# Altium schematic sheet Processor.SchDoc
size C
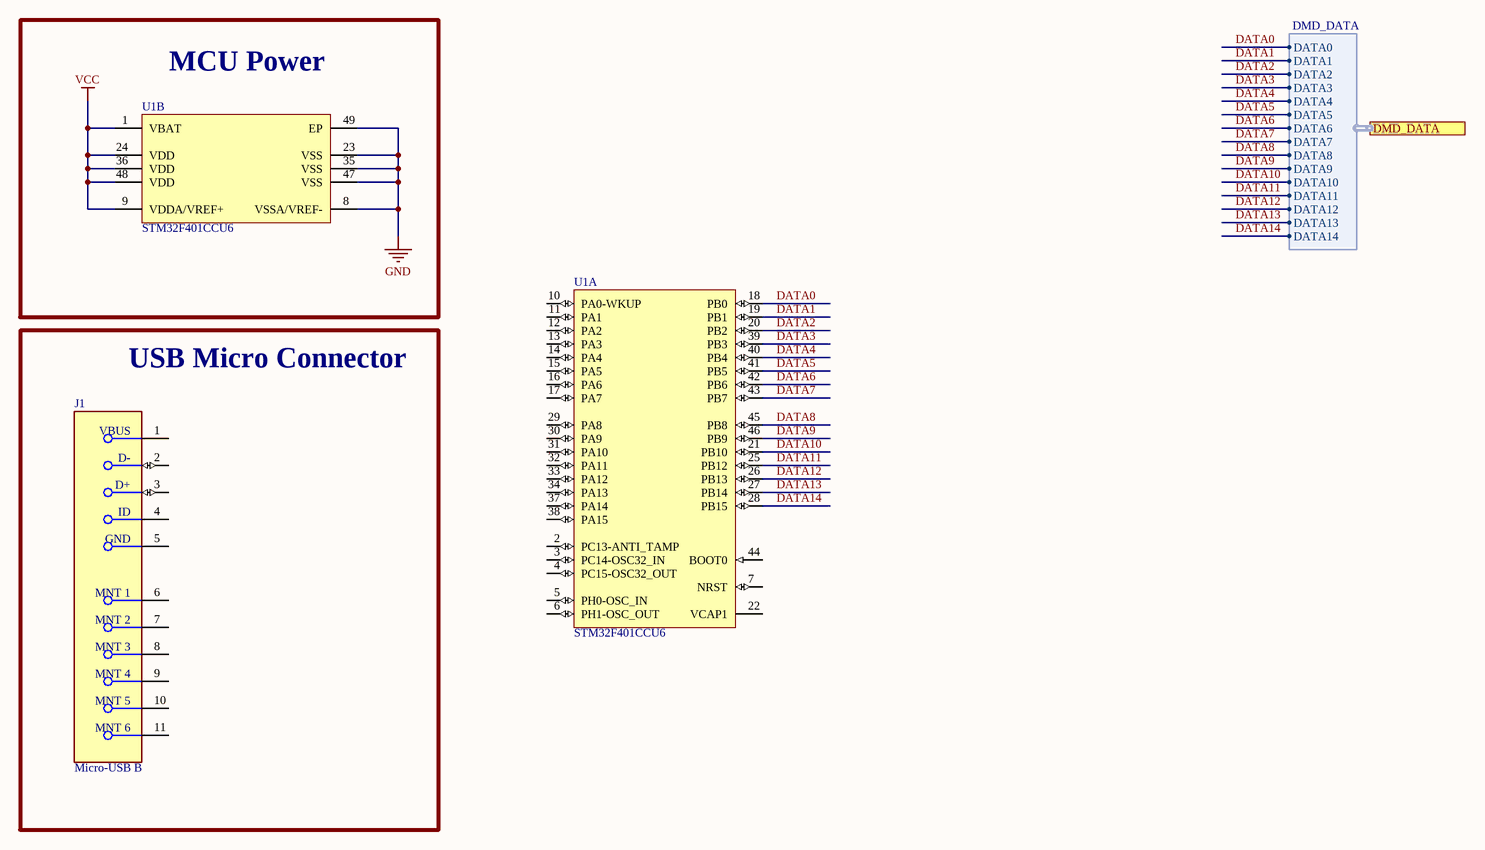
[diagram p0: Processor.SchDoc]

## Parts
J1  Micro-USB B
U1  STM32F401CCU6  [STM-UFQFPN48_N]  (parts A,B of 2)

## Blocks framed on the sheet
MCU Power: U1
USB Micro Connector: J1

## Ports
DMD_DATA (harness DMD_DATA)

## Harnesses
DMD_DATA: DATA0, DATA1, DATA2, DATA3, DATA4, DATA5, DATA6, DATA7, DATA8, DATA10, DATA11, DATA12, DATA13, DATA14, DATA9

## Nets
GND: U1.8(VSSA/VREF-) U1.23(VSS) U1.35(VSS) U1.47(VSS) U1.49(EP)
VCC: U1.1(VBAT) U1.9(VDDA/VREF+) U1.24(VDD) U1.36(VDD) U1.48(VDD)
DATA0: U1.18(PB0) ; port DMD_DATA.DATA0
DATA1: U1.19(PB1) ; port DMD_DATA.DATA1
DATA2: U1.20(PB2) ; port DMD_DATA.DATA2
DATA3: U1.39(PB3) ; port DMD_DATA.DATA3
DATA4: U1.40(PB4) ; port DMD_DATA.DATA4
DATA5: U1.41(PB5) ; port DMD_DATA.DATA5
DATA6: U1.42(PB6) ; port DMD_DATA.DATA6
DATA7: U1.43(PB7) ; port DMD_DATA.DATA7
DATA8: U1.45(PB8) ; port DMD_DATA.DATA8
DATA9: U1.46(PB9) ; port DMD_DATA.DATA9
DATA10: U1.21(PB10) ; port DMD_DATA.DATA10
DATA11: U1.25(PB12) ; port DMD_DATA.DATA11
DATA12: U1.26(PB13) ; port DMD_DATA.DATA12
DATA13: U1.27(PB14) ; port DMD_DATA.DATA13
DATA14: U1.28(PB15) ; port DMD_DATA.DATA14

Not connected (* = marked no-connect by the designer): J1 1(VBUS) 2(D-) 3(D+) 4(ID) 5(GND) 6(MNT_1) 7(MNT_2) 8(MNT_3) 9(MNT_4) 10(MNT_5) 11(MNT_6); U1 2(PC13-ANTI_TAMP) 3(PC14-OSC32_IN) 4(PC15-OSC32_OUT) 5(PH0-OSC_IN) 6(PH1-OSC_OUT) 7(NRST) 10(PA0-WKUP) 11(PA1) 12(PA2) 13(PA3) 14(PA4) 15(PA5) 16(PA6) 17(PA7) 22(VCAP1) 29(PA8) 30(PA9) 31(PA10) 32(PA11) 33(PA12) 34(PA13) 37(PA14) 38(PA15) 44(BOOT0)

## Notes on the sheet
- CONFIDENTAL. Do not distribute.
- Page Contents:
- Title:
- Company
- Logo
- Date:
- SIZE:
- C
- DWG Num:
- Time:
- Variant:
- Sheet
- Revision:
- of
- Drawn by:
- Checked by:

## Library data of the parts
J1 = 47346-0001: Micro-USB B Receptacle with Flange, Bottom Mount, Surface Mount, Lead-Free; Manufacturer: Molex; Supplier 1: Arrow Electronics; Manufacturer Part Number: 47346-0001; RoHS: Yes; Category: Headers and Wire Housings; Stock 1: 5771; Pricing 1: 1=1.09160, 10=0.90940, 25=0.90030, 100=0.76040, 250=0.75290, 500=0.74530, 1000=0.57460, 3000=0.56860, 6000=0.56250 (USD); ComponentLink1URL: https://datasheet.ciiva.com/30075/304740473460001-io-nectors-30075527.pdf?src-supplier=Onlinecomponents.com; ComponentLink1Description: https://datasheet.ciiva.com/30075/304740473460001-io-nectors-30075527.pdf?src-supplier=Onlinecomponents.com; ComponentLink2URL: https://datasheet.ciiva.com/16148/1700180473460001-io-nectors-16148917.pdf?src-supplier=Onlinecomponents.com; ComponentLink2Description: https://datasheet.ciiva.com/16148/1700180473460001-io-nectors-16148917.pdf?src-supplier=Onlinecomponents.com; ComponentLink3URL: https://datasheet.ciiva.com/22654/1630785-22654942.pdf?src-supplier=Element14; ComponentLink3Description: https://datasheet.ciiva.com/22654/1630785-22654942.pdf?src-supplier=Element14; ComponentLink4URL: https://datasheet.ciiva.com/4598/0473460001-io-connectors-146446-4598841.pdf?src-supplier=Mouser; ComponentLink4Description: https://datasheet.ciiva.com/4598/0473460001-io-connectors-146446-4598841.pdf?src-supplier=Mouser; ComponentLink5URL: https://datasheet.ciiva.com/1098/1698067-1098476.pdf?src-supplier=Element14; ComponentLink5Description: https://datasheet.ciiva.com/1098/1698067-1098476.pdf?src-supplier=Element14; ComponentLink6URL: https://datasheet.ciiva.com/11731/0900766b80dfe0a7-11731298.pdf?src-supplier=RSComponents; ComponentLink6Description: https://datasheet.ciiva.com/11731/0900766b80dfe0a7-11731298.pdf?src-supplier=RSComponents; ComponentLink7URL: https://datasheet.ciiva.com/16986/70266948-16986683.pdf?src-supplier=Allied+Electronics; ComponentLink7Description: https://datasheet.ciiva.com/16986/70266948-16986683.pdf?src-supplier=Allied+Electronics; ComponentLink8URL: https://datasheet.ciiva.com/28504/0473460001-io-connectors-28504587.pdf?src-supplier=Element14; ComponentLink8Description: https://datasheet.ciiva.com/28504/0473460001-io-connectors-28504587.pdf?src-supplier=Element14; ComponentLink9URL: https://datasheet.ciiva.com/46390/1681853-46390956.pdf?src-supplier=Element14; ComponentLink9Description: https://datasheet.ciiva.com/46390/1681853-46390956.pdf?src-supplier=Element14; Supplier Part Number 1: 47346-0001
U1 = STM32F401CCU6: ARM Cortex-M4 32-bit MCU+FPU, 105 DMIPS, 256 kB Flash, 64 kB Internal RAM, 36 I/Os, 48-pin UFQFPN, -40 to 85 degC, Tray; Manufacturer: STMicroelectronics; Operating Frequency(F) (Processor speed) (MHz): 84; Supply Voltage(Vcc) min (V): 1.8; FLASH Size (Prog) (kB): 256; Supply Voltage(Vcc) max (V): 3.6; I/Os (High Current): 36; Internal RAM Size (kB): 64; PackageVersion: Rev. 1, 04/2013; Core: ARM Cortex-M4; ComponentLink2Description: Datasheet; ComponentLink1Description: Manufacturer URL; PackageDescription: 48-Pin Ultra Thin Fine Pitch Quad Flat No-Lead, 7 x 7 x 0.6 mm Body, 0.5 mm Pitch, Exposed Pad; ComponentLink3Description: Package Specification; DatasheetVersion: Rev. 1; ComponentLink1URL: http://www.st.com/web/en/home.html; Mounting Technology: Surface Mount; Packing: Tray; ComponentLink3URL: http://www.st.com/st-web-ui/static/active/en/resource/technical/document/data_brief/DM00071938.pdf; PartNumber: STM32F401CCU6; PackageReference: UFQFPN48; ComponentLink2URL: http://www.st.com/st-web-ui/static/active/en/resource/technical/document/data_brief/DM00071938.pdf; Supplier 1: Newark; Supplier Part Number 1: 39X0190